# EAGLE design PoE (EAGLE 9.5.2)
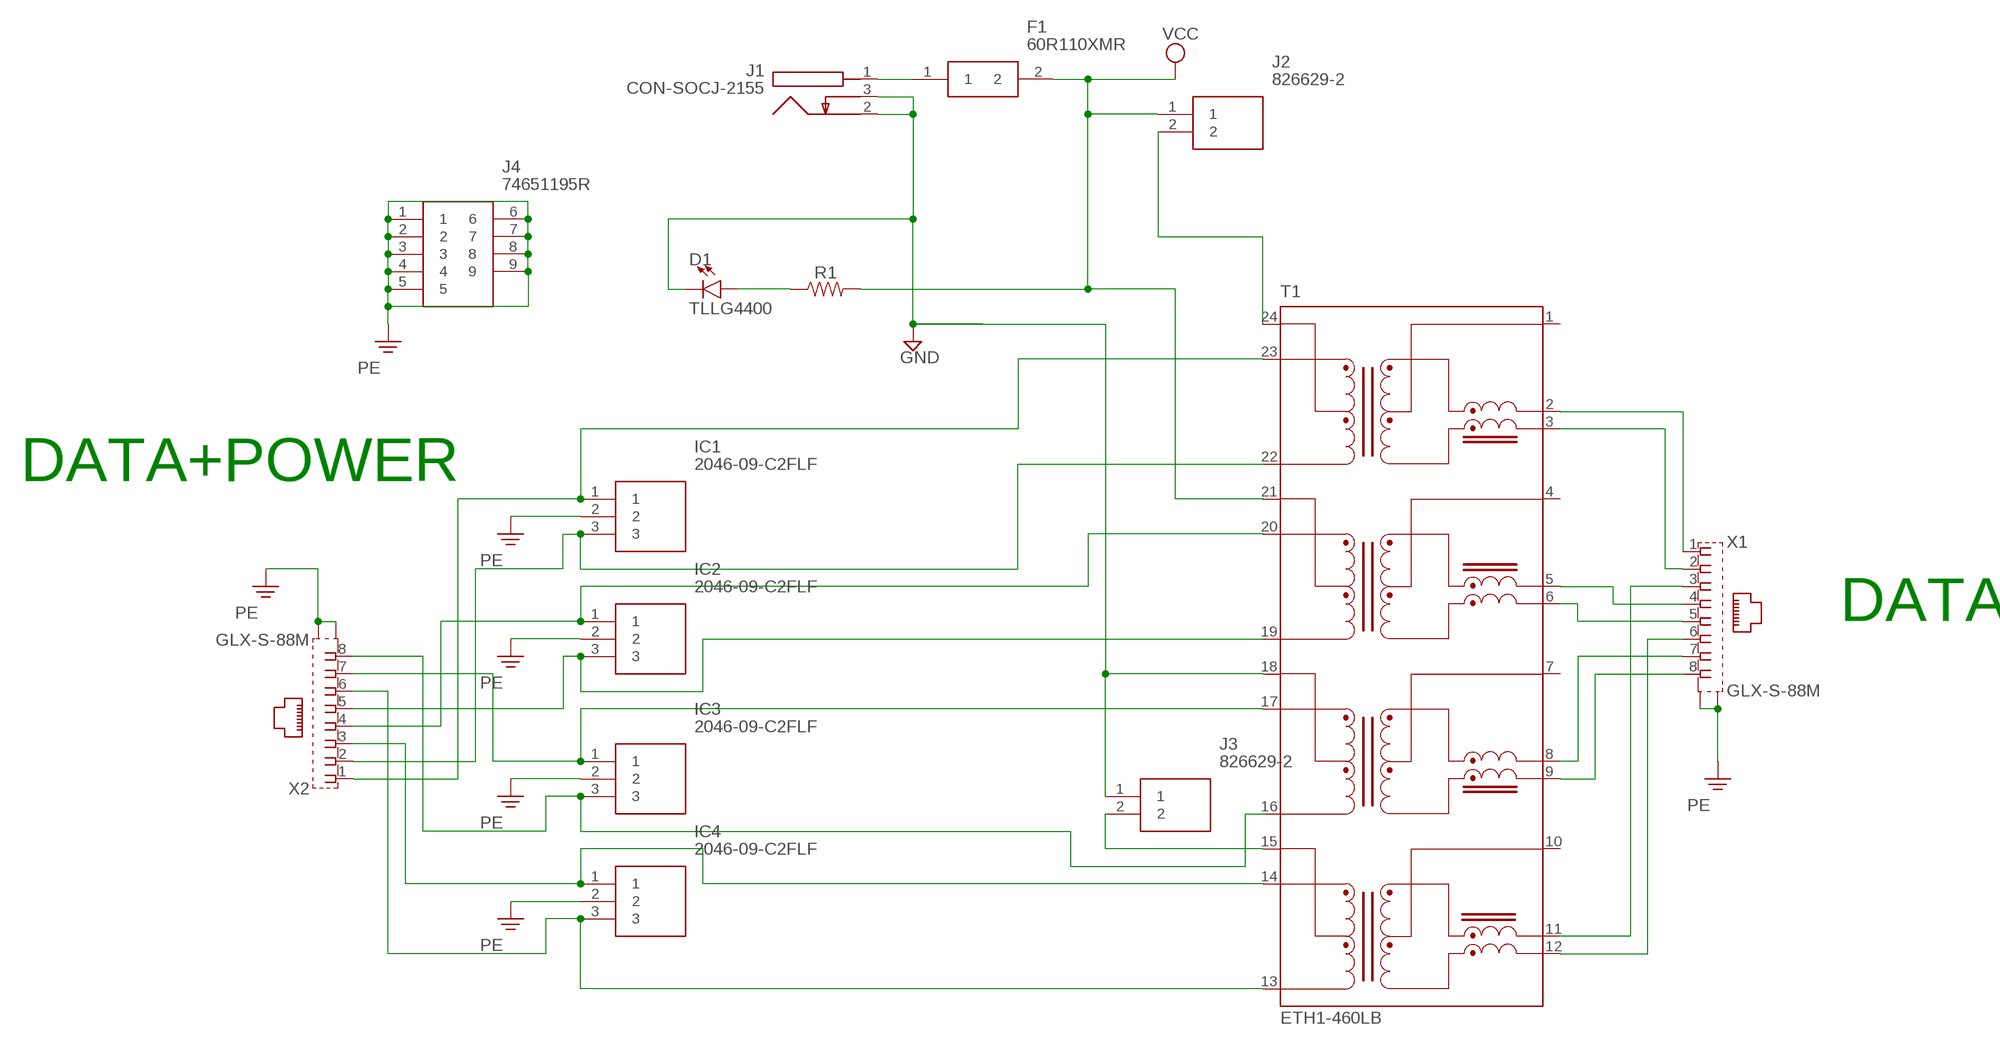
[diagram p0: schematic, sheet 1]

## Parts
D1  TLLG4400  LED3MM  [LED_3MM]
F1  60R110XMR  [60R110XMR]
IC1  2046-09-C2FLF  [204609C2FLF]
IC2  2046-09-C2FLF  [204609C2FLF]
IC3  2046-09-C2FLF  [204609C2FLF]
IC4  2046-09-C2FLF  [204609C2FLF]
J1  CON-SOCJ-2155  [CONSOCJ2155]
J2  826629-2  [HDRV2W85P0X254_1X2_508X250X950]
J3  826629-2  [HDRV2W85P0X254_1X2_508X250X950]
J4  74651195R  [74651195R]
R1  RESISTORAXIAL-0.3  [AXIAL-0.3]
T1  ETH1-460LB  [XFMR_ETH1-460LB]
X1  GLX-S-88M  [GLX-S-88M]
X2  GLX-S-88M  [GLX-S-88M]

## Nets
GND: D1.K(C) J1.2 J1.3 J3.1 T1.18(TXCT_18)
N$1: D1.A R1.P$1
N$2: T1.2(TX+_2) X1.1
N$3: F1.1 J1.1
N$4: T1.3(TX-_3) X1.2
N$5: T1.11(RX+_11) X1.3
N$6: T1.12(RX-_12) X1.6
N$7: T1.5(RX+_5) X1.4
N$8: T1.6(RX-_6) X1.5
N$9: T1.8(TX+_8) X1.7
N$10: T1.9(TX-_9) X1.8
N$11: J2.2 T1.24(TXCT_24)
N$12: J3.2 T1.15(RXCT_15)
N$15: IC1.1 T1.23(TX+_23) X2.1
N$16: IC2.1 T1.20(RX+_20) X2.4
N$17: IC2.3 T1.19(RX-_19) X2.5
N$18: IC3.1 T1.17(TX+_17) X2.7
N$19: IC3.3 T1.16(TX-_16) X2.8
N$20: IC4.1 T1.14(RX+_14) X2.3
N$21: IC4.3 T1.13(RX-_13) X2.6
N$22: IC1.3 T1.22(TX–_22) X2.2
PE: IC1.2 IC2.2 IC3.2 IC4.2 J4.1 J4.2 J4.3 J4.4 J4.5 J4.6 J4.7 J4.8 J4.9 X1.S1 X1.S2 X2.S1 X2.S2
VCC: F1.2 J2.1 R1.P$2 T1.21(RXCT_21)
Unconnected: T1.1(TXCT_1) T1.4(RXCT_4) T1.7(TXCT_7) T1.10(RXCT_10)

## Notes on the sheet
- DATA+POWER
- DATA

## Library data of the parts
D1 = SparkFun-LED:LED: LED (Generic) Standard schematic elements and footprints for 5mm, 3mm, 1206, and 0603 sized LEDs. Generic LEDs with no color specified.; PROD_ID: DIO-08794
F1 = SamacSys_Parts:60R110XMR: LITTELFUSE - 60R110XMR - RESETTABLE FUSE, 60VDC, 40A, RADIAL Source: Datasheet <https://componentsearchengine.com/Datasheets/1/60R110XMR.pdf>; DESCRIPTION: LITTELFUSE - 60R110XMR - RESETTABLE FUSE, 60VDC, 40A, RADIAL; HEIGHT: 18mm; MANUFACTURER_NAME: LITTELFUSE; MANUFACTURER_PART_NUMBER: 60R110XMR; MOUSER_PART_NUMBER: 576-60R110XMR; MOUSER_PRICE-STOCK: https://www.mouser.com/Search/Refine.aspx?Keyword=576-60R110XMR
IC1-IC4 = SamacSys_Parts:2046-09-C2FLF: Gas Discharge Tubes - GDTs / Gas Plasma Arrestors 90V 20kA 8x10mm Radial 3-Electrode Source: Datasheet <https://componentsearchengine.com/Datasheets/1/2046-09-C2FLF.pdf>; DESCRIPTION: Gas Discharge Tubes - GDTs / Gas Plasma Arrestors 90V 20kA 8x10mm Radial 3-Electrode; HEIGHT: 10.5mm; MANUFACTURER_NAME: Bourns; MANUFACTURER_PART_NUMBER: 2046-09-C2FLF; MOUSER_PART_NUMBER: 652-2046-09-C2FLF; MOUSER_PRICE-STOCK: https://www.mouser.com/Search/Refine.aspx?Keyword=652-2046-09-C2FLF
J1 = SamacSys_Parts:CON-SOCJ-2155: DC Power Connectors Power Jack/Connector 2.1mm x 5.5mm Source: Datasheet <http://www.produktinfo.conrad.com/datenblaetter/1500000-1599999/001582350-da-01-en-DC_EINBAUBUCHSE__SCHALTER_GESCHLOSSEN.pdf>; DESCRIPTION: DC Power Connectors Power Jack/Connector 2.1mm x 5.5mm; HEIGHT: 11mm; MANUFACTURER_NAME: Gravitech; MANUFACTURER_PART_NUMBER: CON-SOCJ-2155; MOUSER_PART_NUMBER: 992-CON-SOCJ-2155; MOUSER_PRICE-STOCK: https://www.mouser.com/Search/Refine.aspx?Keyword=992-CON-SOCJ-2155
J2 J3 = SamacSys_Parts:826629-2: 2w Single row Straight header gold TE Connectivity AMPMODU Series, 2.54mm Pitch 2 Way 1 Row Straight PCB Header, Solder Termination, 3A Source: Datasheet <https://componentsearchengine.com/Datasheets/1/826629-2.pdf>; DESCRIPTION: 2w Single row Straight header gold TE Connectivity AMPMODU Series, 2.54mm Pitch 2 Way 1 Row Straight PCB Header, Solder Termination, 3A; HEIGHT: 9.5mm; MANUFACTURER_NAME: TE Connectivity; MANUFACTURER_PART_NUMBER: 826629-2; MOUSER_PART_NUMBER: 571-826629-2; MOUSER_PRICE-STOCK: https://www.mouser.com/Search/Refine.aspx?Keyword=571-826629-2
J4 = SamacSys_Parts:74651195R: Wurth Elektronik WP-THRSH 9 Pin PCB Screw Terminal, 85A, Solder, M5 Source: Datasheet <https://componentsearchengine.com/Datasheets/1/74651195R.pdf>; DESCRIPTION: Wurth Elektronik WP-THRSH 9 Pin PCB Screw Terminal, 85A, Solder, M5; HEIGHT: 10.5mm; MANUFACTURER_NAME: Wurth Elektronik; MANUFACTURER_PART_NUMBER: 74651195R; MOUSER_PART_NUMBER: 710-74651195R; MOUSER_PRICE-STOCK: https://www.mouser.com/Search/Refine.aspx?Keyword=710-74651195R
R1 = SparkFun-Resistors:RESISTOR: Generic Resistor Package
T1 = ETH1-460LB:ETH1-460LB: Ethernet signal path magnetics module, SMT, RoHS; AVAILABILITY: Unavailable; DESCRIPTION: Ethernet signal path magnetics module, SMT, RoHS; MF: Coilcraft; MP: ETH1-460LB; PACKAGE: None; PRICE: None
X1 X2 = con-kycon:GLX-S-88M: Mod. Jack, Right Angle, 8 posiotion, 8 contatcs RJ45 Source: GLX-S-88M.pdf; OC_FARNELL: unknown; OC_NEWARK: unknown

## Board
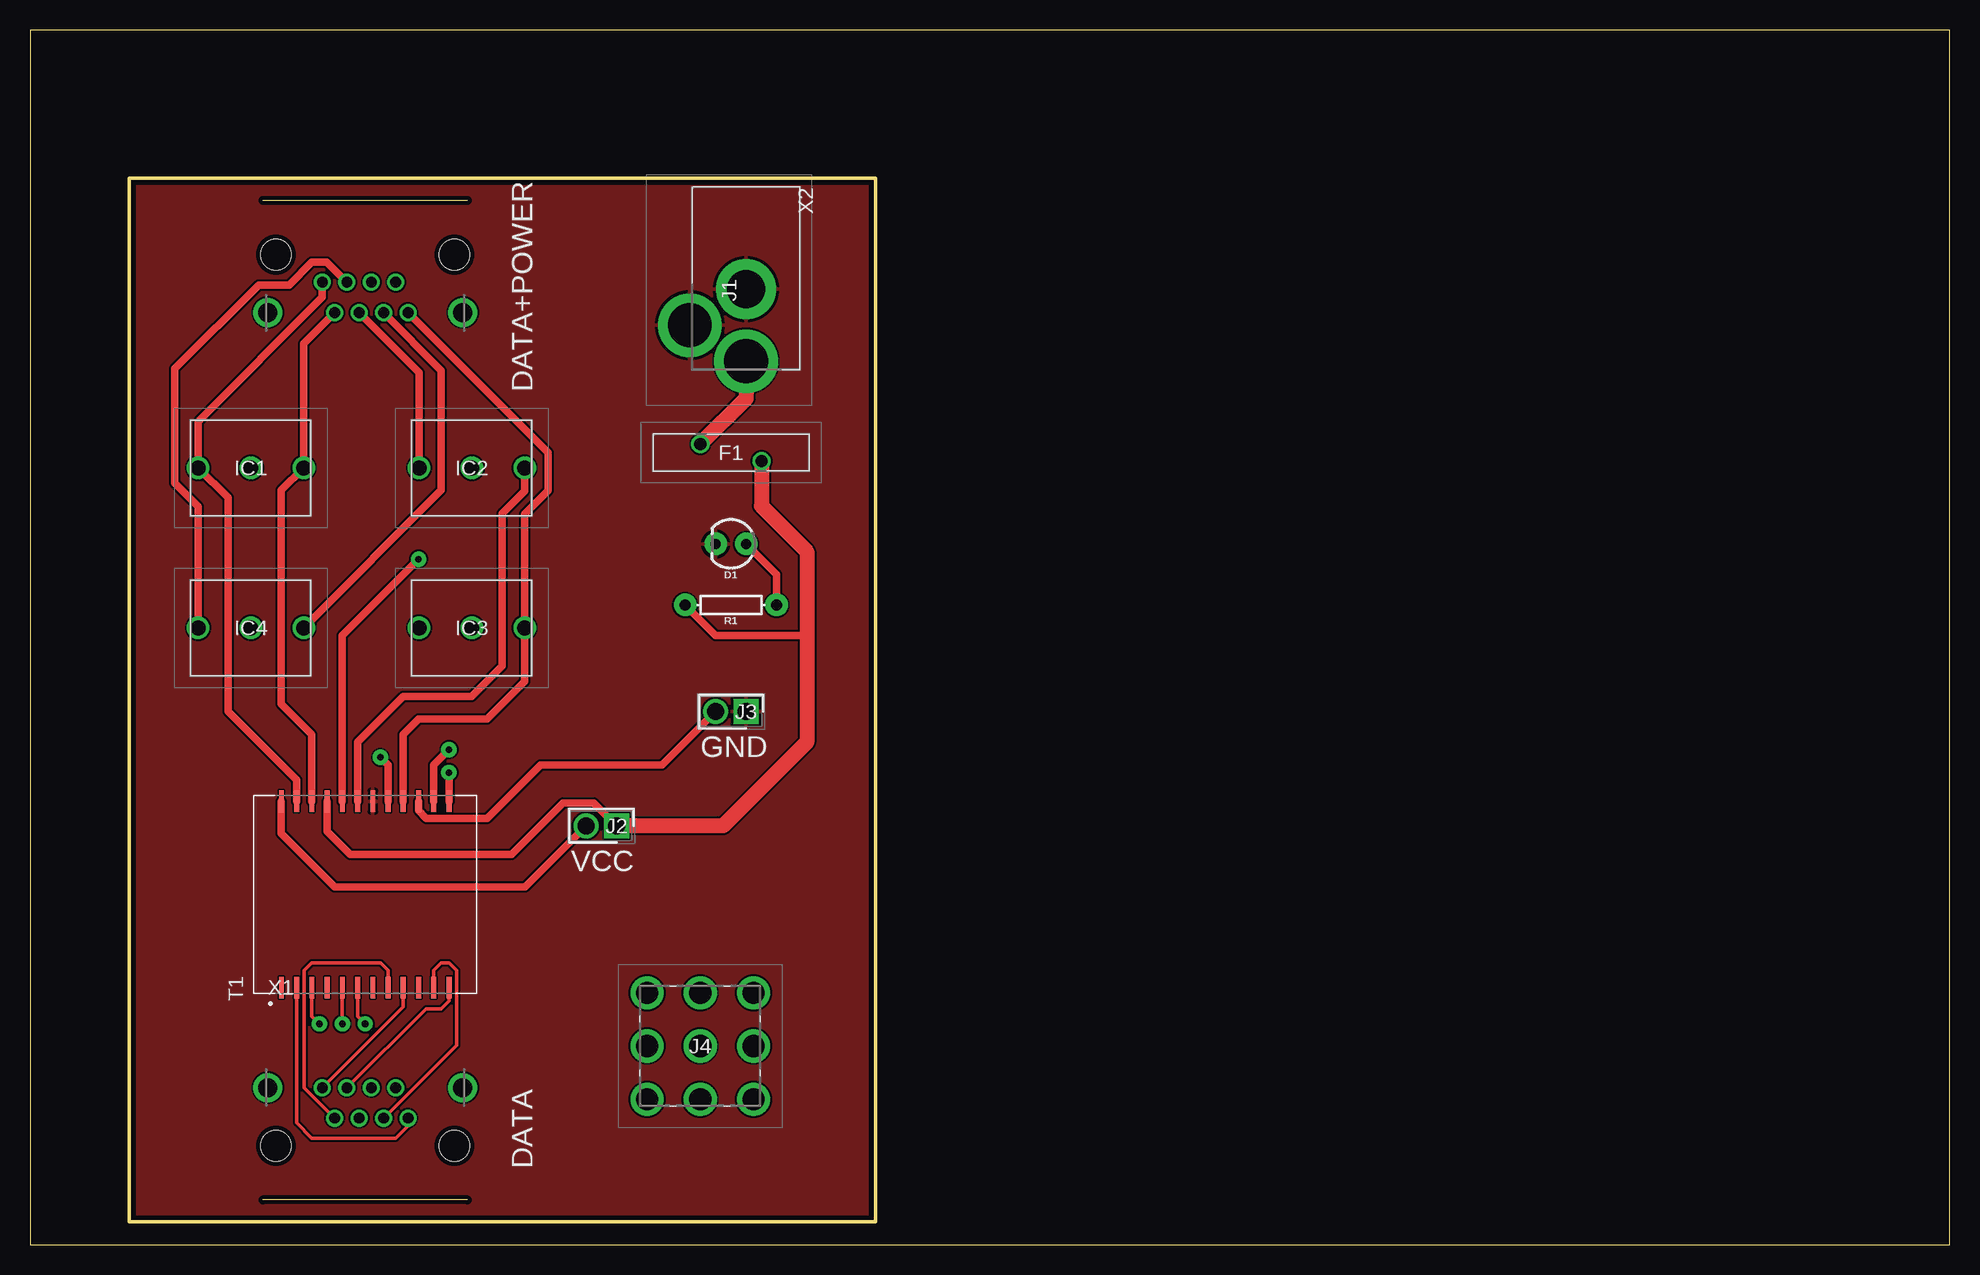
[diagram p1: board, top side]
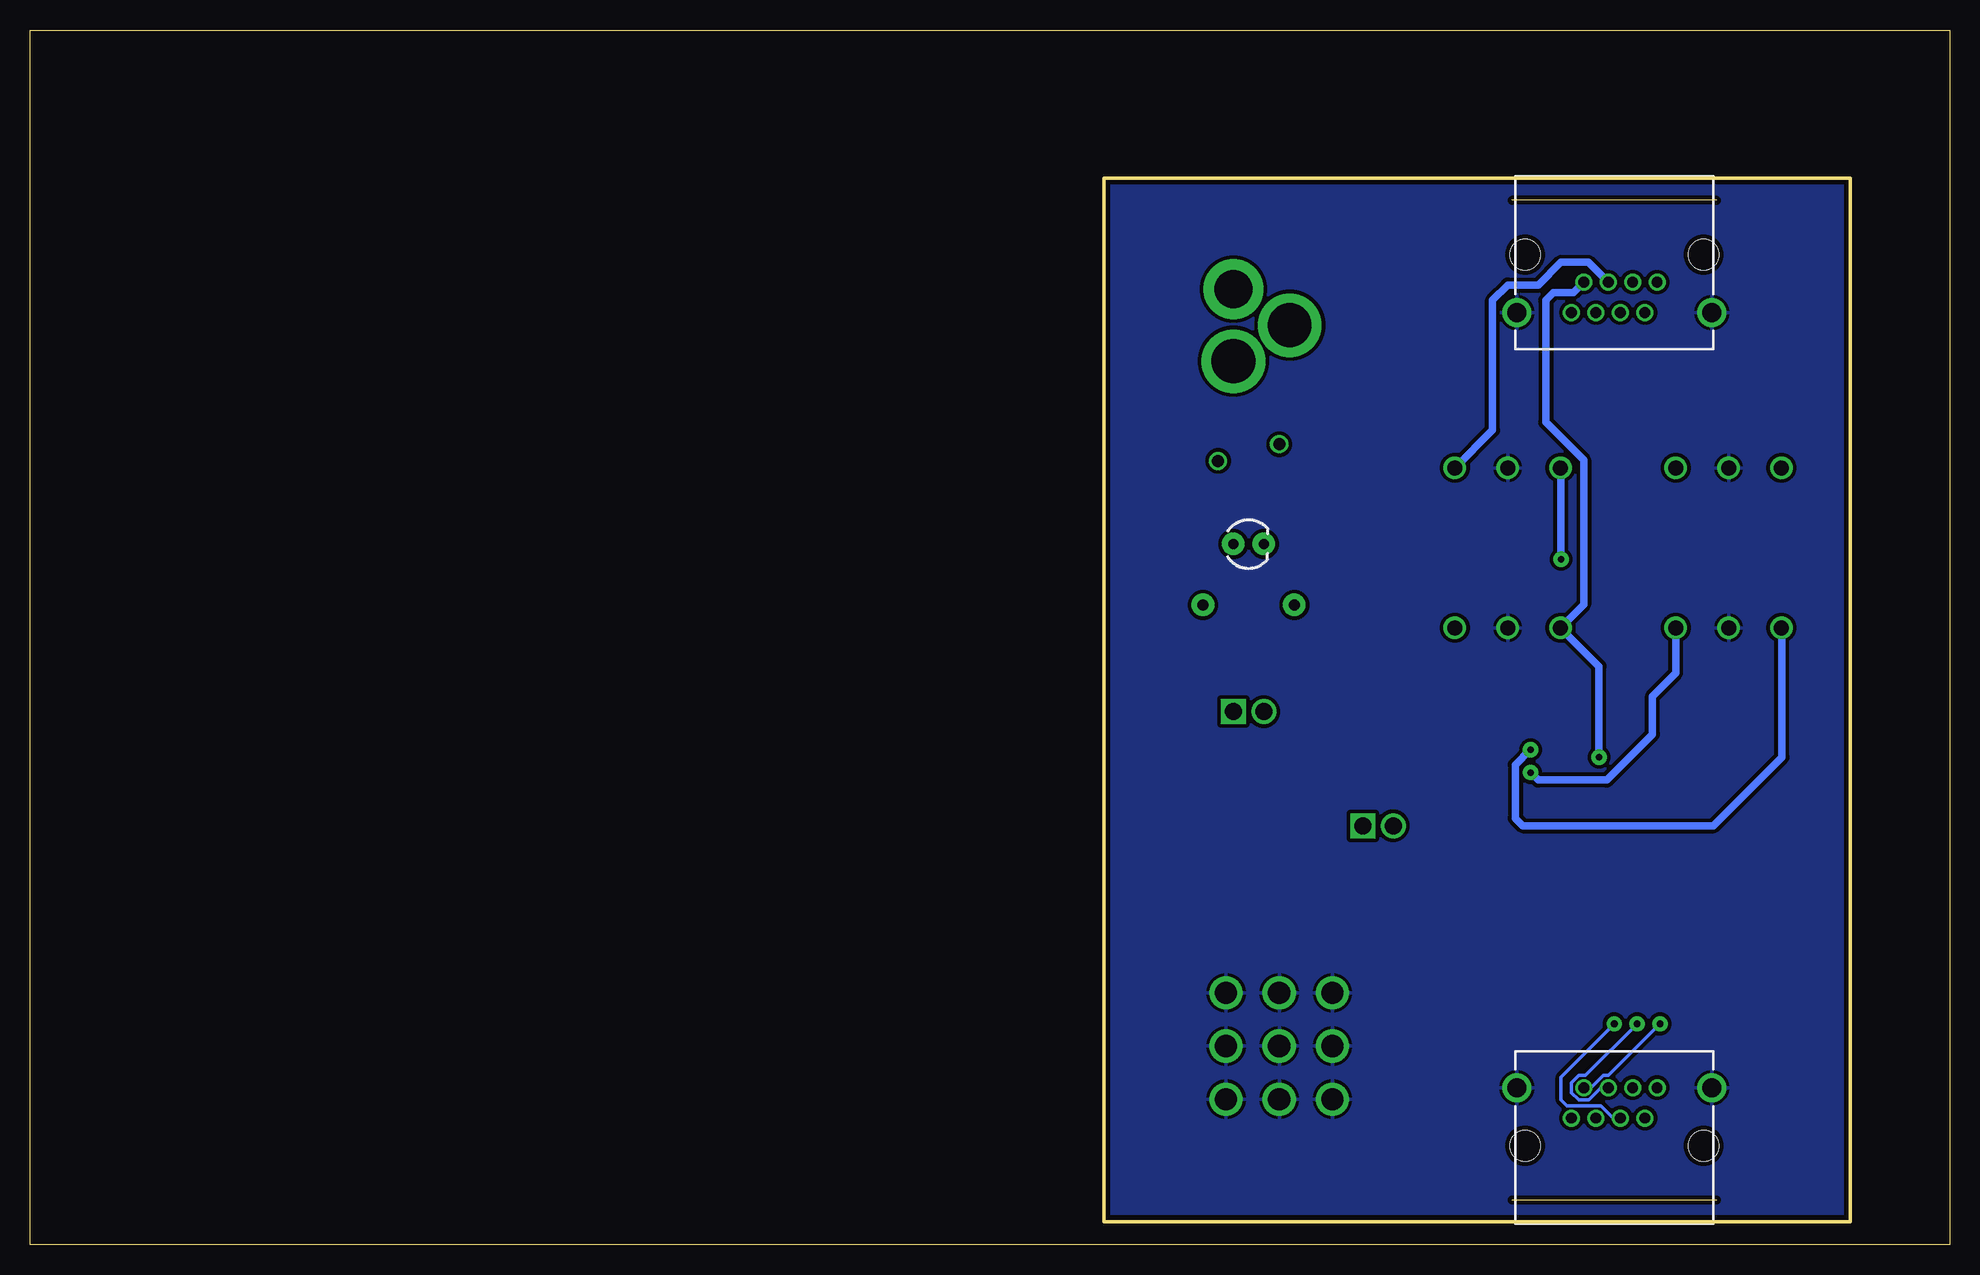
[diagram p2: board, bottom side, seen from below]

Size 160 x 101.27 mm. Coordinates in mm from the lower left corner, seen from the top.
Outline: 0,0 160,0 160,101.27 0,101.27 0,0
Outline: 8.26,88.9 70.48,88.9 70.48,1.91 8.26,1.91 8.26,88.9
Copper layers (1*16): Top 0.035559375mm / dielectric 1.6mm / Bottom 0.035559375mm
Design rules "oshpark-2layer *": minimum track width 10mil, minimum drill 10mil, track to track 6mil, track to pad 6mil, pad to pad 6mil, via to via 6mil, smd to smd 6mil, copper to edge 15mil, drill to drill 6mil, minimum pad ring 5mil, minimum via ring 5mil, stop-mask expansion 2.5mil, vias tented up to drill 0mil, thermal gap 10mil

### Footprints (pad centres in the part's own frame; a part is rotated, then mirrored left to right if it is on the bottom)
LED_3MM = drill 0.813 pad 1.88: A -1.27,0; K 1.27,0
60R110XMR = drill 1.01 pad 1.515: 1 -2.55,0.7; 2 2.55,-0.7
204609C2FLF = drill 1.25 pad 1.875: 1 -4.4,0; 2 0,0; 3 4.4,0
CONSOCJ2155 = drill 3.64 pad 5.3: 1 0,0; 3 -3,-4.7 | drill 3.162 pad 5: 2 -6,0
HDRV2W85P0X254_1X2_508X250X950 = drill 1.4 pad 2.1 square: 1 0,0 | drill 1.4 pad 2.1: 2 2.54,0
74651195R = drill 1.85 pad 2.775: 1 0,0.065; 2 4.435,0.065; 3 8.87,0.065; 4 0,4.5; 5 4.435,4.5; 6 8.87,4.5; 7 0,8.935; 8 4.435,8.935; 9 8.87,8.935
AXIAL-0.3 = drill 0.9 pad 1.88: P$1 -3.81,0; P$2 3.81,0
XFMR_ETH1-460LB = smd 1.78 x 0.4: 1 -7.765,6.985; 2 -7.765,5.715; 3 -7.765,4.445; 4 -7.765,3.175; 5 -7.765,1.905; 6 -7.765,0.635; 7 -7.765,-0.635; 8 -7.765,-1.905; 9 -7.765,-3.175; 10 -7.765,-4.445; 11 -7.765,-5.715; 12 -7.765,-6.985; 13 7.765,-6.985; 14 7.765,-5.715; 15 7.765,-4.445; 16 7.765,-3.175; 17 7.765,-1.905; 18 7.765,-0.635; 19 7.765,0.635; 20 7.765,1.905; 21 7.765,3.175; 22 7.765,4.445; 23 7.765,5.715; 24 7.765,6.985
GLX-S-88M = drill 0.9 pad 1.422: 1 -3.57,-2.3; 2 -2.55,-4.84; 3 -1.53,-2.3; 4 -0.51,-4.84; 5 0.51,-2.3; 6 1.53,-4.84; 7 2.55,-2.3; 8 3.57,-4.84 | drill 1.6 pad 2.184: S1 -8.125,-4.84; S2 8.125,-4.84 | hole 2.55: -7.44,0; 7.44,0

### Placement (x,y rotation side)
D1  58.42,58.42 180 top
F1  58.42,66.04 0 top
IC1  18.41,64.77 0 top
IC2  36.83,64.77 0 top
IC3  36.83,51.44 0 top
IC4  18.41,51.44 0 top
J1  59.69,73.66 270 top
J2  48.9,34.93 180 top
J3  59.69,44.45 180 top
J4  51.44,12.06 0 top
R1  58.42,53.34 180 top
T1  27.94,29.21 90 top
X1  27.94,8.26 180 top
X2  27.94,82.55 0 top

### Tracks (layer width: path | path; a pad name or v marks a point on that pad's centre or on a via)
GND
  pour Top (isolate 0.305): 8.26,88.9 70.48,88.9 70.48,1.91 8.26,1.91
  pour Top (isolate 0.305): 8.26,88.9 70.48,88.9 70.48,1.91 8.26,1.91
  pour Top: 8.26,88.9 70.48,88.9 70.48,1.91 8.26,1.91
N$1
  Top 0.635: D1.A 62.23,55.88 R1.P$1
N$2
  Top 0.305: T1.2 22.23,10.16 23.5,8.89 30.48,8.89 31.51,9.92 X1.1
N$3
  Top 1.27: J1.1 59.69,70.56 F1.1
N$4  (via drill 0.55 pad 1.27)
  Top 0.305: T1.3 23.5,19.05 v24.13,18.41
  Bottom 0.305: v24.13,18.41 28.43,14.11 28.87,14.11 29.89,13.09 X1.2
N$5
  Top 0.305: X1.3 35.56,16.64 35.56,22.86 34.92,23.5 34.29,23.5 33.66,22.86 T1.11
N$6
  Top 0.305: X1.6 33,19.68 34.29,19.68 34.92,20.32 T1.12
N$7  (via drill 0.55 pad 1.27)
  Top 0.305: T1.5 v26.04,18.41
  Bottom 0.305: v26.04,18.41 30.34,14.11 30.91,14.11 31.51,13.52 31.51,12.67 30.91,12.08 30.07,12.08 29.05,13.09 X1.4
N$8  (via drill 0.55 pad 1.27)
  Top 0.305: T1.6 27.3,19.05 v27.94,18.41
  Bottom 0.305: v27.94,18.41 32.38,13.97 32.38,12.06 31.89,11.57 29.05,11.57 28.03,10.55 X1.5
N$9
  Top 0.305: X1.7 22.86,13.08 22.86,22.86 23.5,23.5 29.21,23.5 29.84,22.86 T1.8
N$10
  Top 0.305: X1.8 31.11,19.84 T1.9
N$11
  Top 0.635: T1.24 20.95,34.29 25.4,29.84 41.27,29.84 J2.2
N$12
  Top 0.635: J3.2 52.7,40.01 42.55,40.01 38.1,35.56 33.02,35.56 32.38,36.2 T1.15
N$15
  Top 0.635: X2.1 24.37,78.98 14.02,68.62 IC1.1 16.51,62.28 16.51,44.45 22.23,38.74 T1.23
N$16  (via drill 0.55 pad 1.27)
  Top 0.635: IC2.1 32.43,72.71 X2.4 | T1.20 26.04,50.8 v32.38,57.15
  Bottom 0.635: v32.38,57.15 32.38,64.72 IC2.1
N$17
  Top 0.635: IC2.3 41.23,62.82 39.37,60.96 39.37,48.26 36.83,45.72 31.11,45.72 27.3,41.91 T1.19
  Bottom 0.635: IC2.3 38.1,67.9 38.1,78.74 36.83,80.01 34.29,80.01 32.38,81.91 30.11,81.91 X2.5
N$18  (via drill 0.55 pad 1.27)
  Top 0.635: T1.17 29.84,40.01 v29.21,40.64
  Bottom 0.635: X2.7 31.36,79.38 33.02,79.38 33.66,78.74 33.66,68.58 30.48,65.41 30.48,53.39 IC3.1 29.21,48.22 v29.21,40.64
N$19
  Top 0.635: T1.16 31.11,42.55 32.38,43.82 38.1,43.82 41.23,46.95 IC3.3 41.23,60.92 43.18,62.87 43.18,66.04 X2.8
N$20  (via drill 0.55 pad 1.27)
  Top 0.635: X2.3 24.75,81.91 23.5,81.91 21.59,80.01 19.05,80.01 12.06,73.02 12.06,63.5 14.02,61.55 IC4.1 | T1.14 33.66,40.01 v34.92,41.28
  Bottom 0.635: IC4.1 13.97,51.39 13.97,40.64 19.68,34.93 35.56,34.93 36.2,35.56 36.2,40.01 v34.92,41.28
N$21  (via drill 0.55 pad 1.27)
  Top 0.635: X2.6 34.29,72.89 34.29,62.91 IC4.3 | v34.92,39.37 T1.13
  Bottom 0.635: v34.92,39.37 34.29,38.74 28.57,38.74 24.77,42.55 24.77,45.72 22.82,47.67 IC4.3
N$22
  Top 0.635: X2.2 22.82,75.13 IC1.3 20.95,62.91 20.95,45.09 23.5,42.55 T1.22
PE
  pour Bottom (isolate 0.305): 8.26,88.9 70.48,88.9 70.48,1.91 8.26,1.91
VCC
  Top 0.635: 64.77,50.8 57.15,50.8 R1.P$2 | J2.1 46.99,36.83 44.45,36.83 40.16,32.54 26.67,32.54 24.77,34.44 T1.21
  Top 1.27: F1.2 60.97,61.59 64.77,57.79 64.77,50.8 64.77,41.91 57.78,34.93 J2.1

### Text on the board
tPlace: DATA+POWER | GND | VCC | DATA